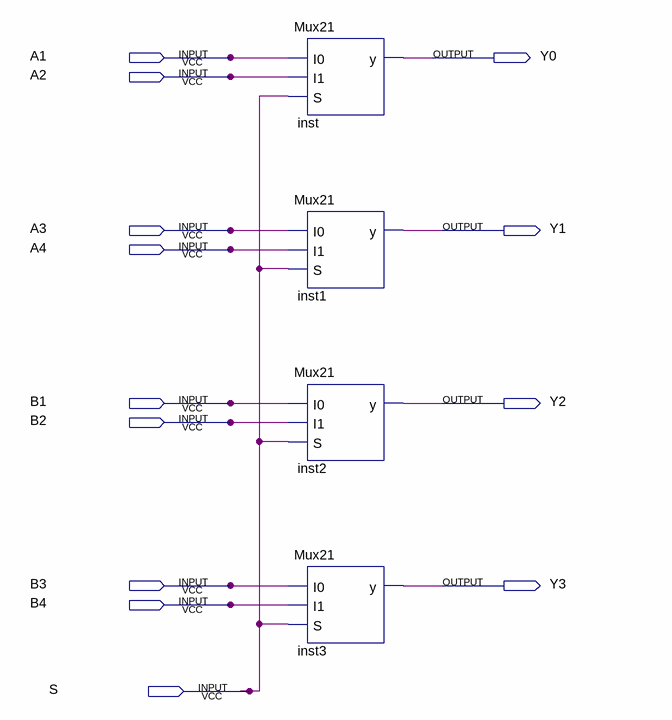
[diagram p0: schematic sheet]
// Quartus schematic MuxCua.bdf as structural Verilog: 4 symbols, 13 pins
module MuxCua (
  input  A1,
  input  A2,
  input  A3,
  input  A4,
  input  B1,
  input  B2,
  input  B3,
  input  B4,
  input  S,
  output Y0,
  output Y1,
  output Y2,
  output Y3
);

  Mux21 inst (.I0(A1), .I1(A2), .S(S), .y(Y0));
  Mux21 inst1 (.I0(A3), .I1(A4), .S(S), .y(Y1));
  Mux21 inst2 (.I0(B1), .I1(B2), .S(S), .y(Y2));
  Mux21 inst3 (.I0(B3), .I1(B4), .S(S), .y(Y3));
endmodule
